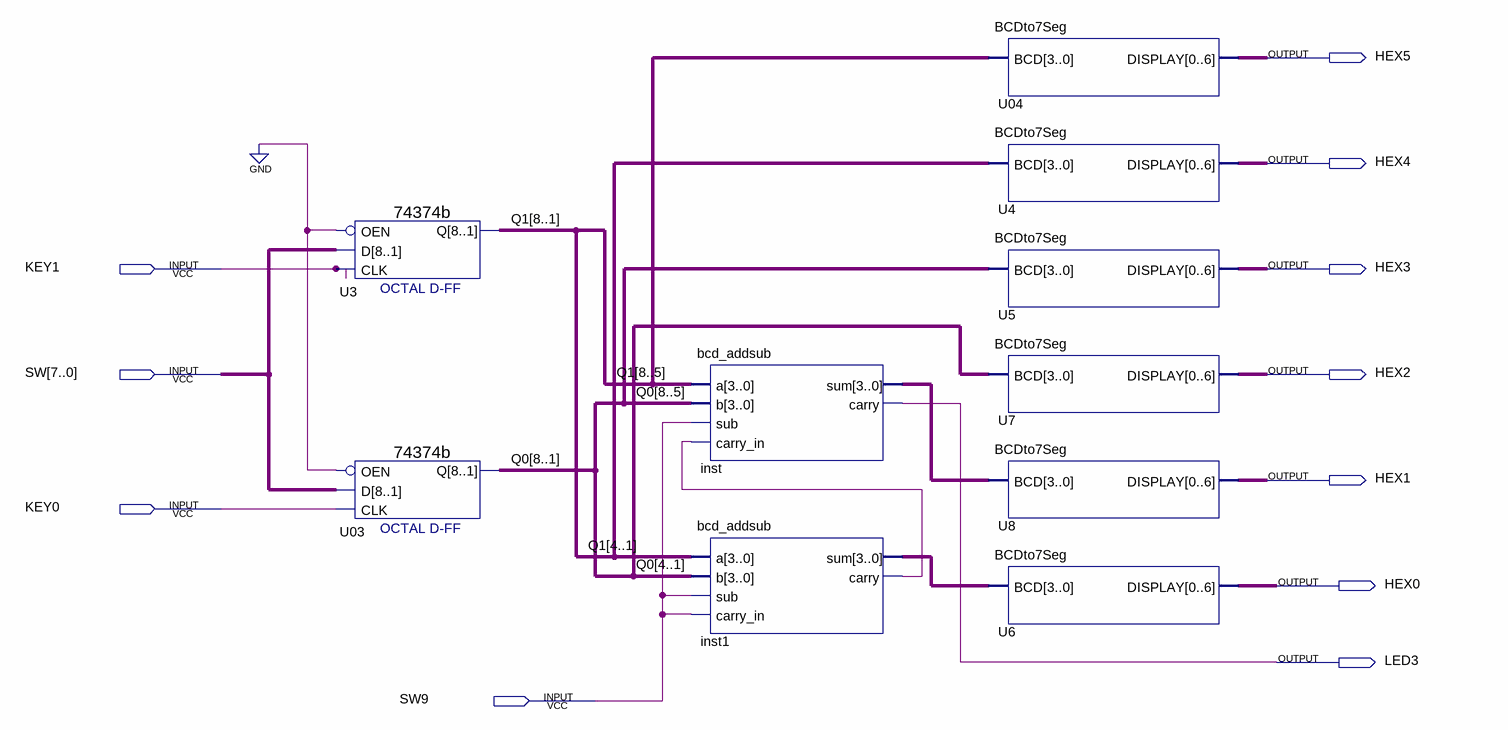
[diagram p0: schematic sheet]
// Quartus schematic BCDaddsub.bdf as structural Verilog: 10 symbols, 11 pins
module BCDaddsub (
  input  KEY1,
  input  [7:0] SW,
  input  KEY0,
  input  SW9,
  output HEX5,
  output HEX4,
  output HEX3,
  output HEX2,
  output HEX1,
  output HEX0,
  output LED3
);

  wire inst1_carry;
  wire [3:0] inst1_sum, inst_sum;
  wire [6:0] U4_display, U04_display, U5_display, U6_display, U7_display, U8_display;
  wire [8:1] Q0, Q1;

  \74374b  U3 (.D(SW), .OEN(1'b0), .CLK(KEY1), .Q(Q1));
  \74374b  U03 (.D(SW), .OEN(1'b0), .CLK(KEY0), .Q(Q0));
  bcd_addsub inst (.a(Q1[8:5]), .b(Q0[8:5]), .sub(SW9), .carry_in(inst1_carry), .sum(inst_sum), .carry(LED3));
  bcd_addsub inst1 (.a(Q1[4:1]), .b(Q0[4:1]), .sub(SW9), .carry_in(SW9), .sum(inst1_sum), .carry(inst1_carry));
  BCDto7Seg U04 (.BCD(Q1[8:5]), .DISPLAY(U04_display));
  BCDto7Seg U4 (.BCD(Q1[4:1]), .DISPLAY(U4_display));
  BCDto7Seg U5 (.BCD(Q0), .DISPLAY(U5_display));
  BCDto7Seg U7 (.BCD(Q0[4:1]), .DISPLAY(U7_display));
  BCDto7Seg U8 (.BCD(inst_sum), .DISPLAY(U8_display));
  BCDto7Seg U6 (.BCD(inst1_sum), .DISPLAY(U6_display));
endmodule
